# Altium project Z02.PrjPcb
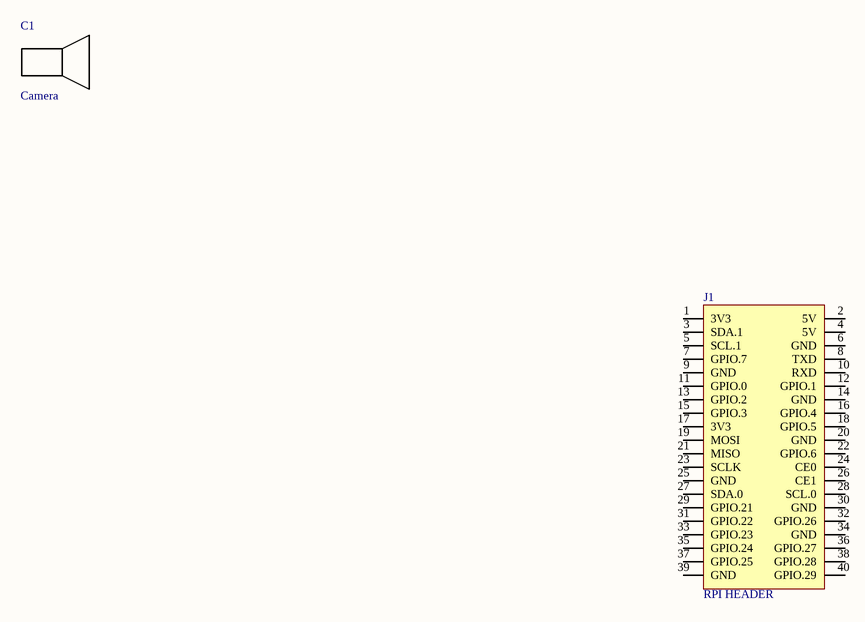
[diagram p0: Sheet1.SchDoc]
1 sheet, 2 parts. Net scope: global (net labels, ports and power ports of the same name join across sheets).
Board files: PCB1.PcbDoc, PCB2.PcbDoc

## Sheet Sheet1.SchDoc
size A4; SheetNumber: 1; SheetTotal: 1

### Parts
C1  Camera  [RPi-HQ-CAMERA-CONVERTER]
J1  RPI HEADER  [HEADER 2*20 SMD FRONT]

### Nets

Not connected (* = marked no-connect by the designer): J1 1(3V3) 2(5V) 3(SDA.1) 4(5V) 5(SCL.1) 6(GND) 7(GPIO.7) 8(TXD) 9(GND) 10(RXD) 11(GPIO.0) 12(GPIO.1) 13(GPIO.2) 14(GND) 15(GPIO.3) 16(GPIO.4) 17(3V3) 18(GPIO.5) 19(MOSI) 20(GND) 21(MISO) 22(GPIO.6) 23(SCLK) 24(CE0) 25(GND) 26(CE1) 27(SDA.0) 28(SCL.0) 29(GPIO.21) 30(GND) 31(GPIO.22) 32(GPIO.26) 33(GPIO.23) 34(GND) 35(GPIO.24) 36(GPIO.27) 37(GPIO.25) 38(GPIO.28) 39(GND) 40(GPIO.29)